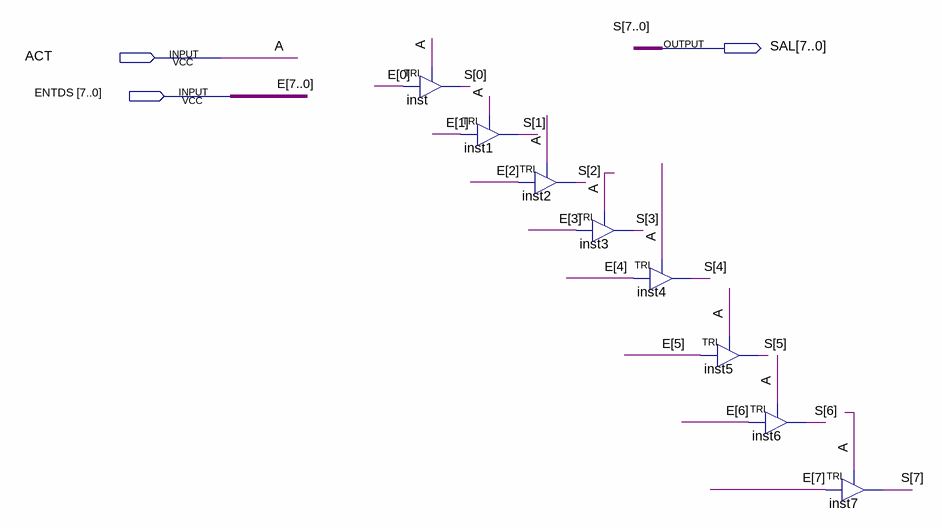
[diagram p0: schematic sheet]
// Quartus schematic TRIEDO.bdf as structural Verilog: 8 symbols, 3 pins
module TRIEDO (
  input  ACT,
  input  [7:0] ENTDS,
  output [7:0] SAL
);

  TRI inst (.IN(ENTDS[0]), .OE(ACT), .OUT(SAL[0]));
  TRI inst1 (.IN(ENTDS[1]), .OE(ACT), .OUT(SAL[1]));
  TRI inst2 (.IN(ENTDS[2]), .OE(ACT), .OUT(SAL[2]));
  TRI inst3 (.IN(ENTDS[3]), .OE(ACT), .OUT(SAL[3]));
  TRI inst4 (.IN(ENTDS[4]), .OE(ACT), .OUT(SAL[4]));
  TRI inst5 (.IN(ENTDS[5]), .OE(ACT), .OUT(SAL[5]));
  TRI inst6 (.IN(ENTDS[6]), .OE(ACT), .OUT(SAL[6]));
  TRI inst7 (.IN(ENTDS[7]), .OE(ACT), .OUT(SAL[7]));

  // Other names for the same wires on the sheet: A = ACT; E[7:0] = ENTDS; S[7:0] = SAL
endmodule
